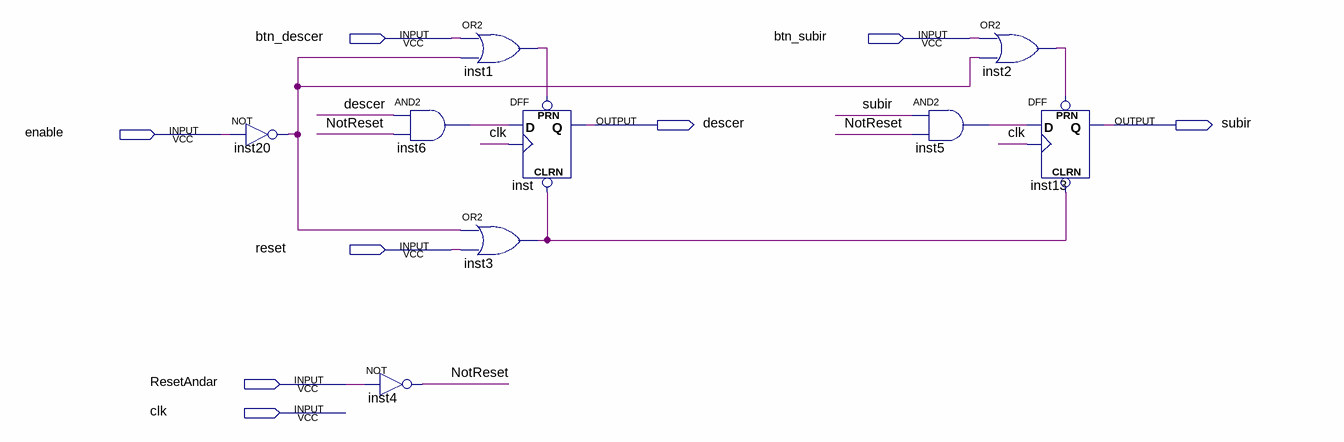
[diagram p0: schematic sheet]
// Quartus schematic REG_andar.bdf as structural Verilog: 9 symbols, 8 pins
module REG_andar (
  input  btn_descer,
  input  btn_subir,
  input  enable,
  input  reset,
  input  ResetAndar,
  input  clk,
  output descer,
  output subir
);

  wire inst1_out, inst2_out, inst3_out, inst5_out, inst6_out, inst20_out, NotReset;

  not inst20 (inst20_out, enable);
  and inst6 (inst6_out, descer, NotReset);
  not inst4 (NotReset, ResetAndar);
  or inst1 (inst1_out, btn_descer, inst20_out);
  or inst3 (inst3_out, inst20_out, reset);
  DFF inst (.CLRN(inst3_out), .CLK(clk), .D(inst6_out), .PRN(inst1_out), .Q(descer));
  and inst5 (inst5_out, subir, NotReset);
  or inst2 (inst2_out, btn_subir, inst20_out);
  DFF inst13 (.CLRN(inst3_out), .CLK(clk), .D(inst5_out), .PRN(inst2_out), .Q(subir));
endmodule
